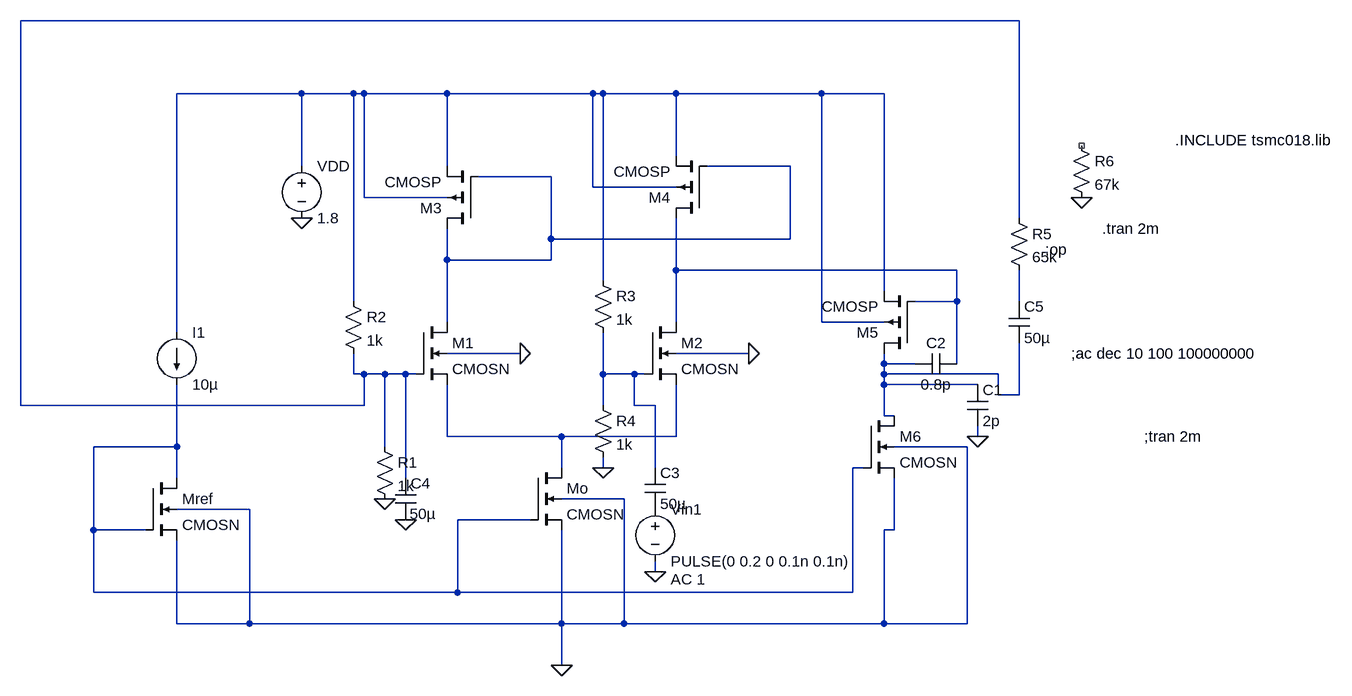
[diagram p0: schematic Schematic.asc]
Schematic.asc, the LTspice schematic file:
Version 4
SHEET 1 1564 724
WIRE 1040 -336 -496 -336
WIRE -64 -224 -256 -224
WIRE 16 -224 -64 -224
WIRE 32 -224 16 -224
WIRE 160 -224 32 -224
WIRE 384 -224 160 -224
WIRE 400 -224 384 -224
WIRE 512 -224 400 -224
WIRE 736 -224 512 -224
WIRE 832 -224 736 -224
WIRE 512 -128 512 -224
WIRE -64 -112 -64 -224
WIRE 160 -112 160 -224
WIRE 688 -112 560 -112
WIRE 320 -96 208 -96
WIRE 384 -80 384 -224
WIRE 512 -80 384 -80
WIRE 32 -64 32 -224
WIRE 160 -64 32 -64
WIRE 1040 -32 1040 -336
WIRE 320 0 320 -96
WIRE 688 0 688 -112
WIRE 688 0 320 0
WIRE 160 32 160 -16
WIRE 320 32 320 0
WIRE 320 32 160 32
WIRE 512 48 512 -32
WIRE 944 48 512 48
WIRE 400 64 400 -224
WIRE 832 80 832 -224
WIRE 16 96 16 -224
WIRE 944 96 944 48
WIRE 944 96 880 96
WIRE 1040 96 1040 48
WIRE 160 128 160 32
WIRE 512 128 512 48
WIRE 736 128 736 -224
WIRE 832 128 736 128
WIRE -256 144 -256 -224
WIRE 272 176 160 176
WIRE 624 176 512 176
WIRE 832 192 832 176
WIRE 880 192 832 192
WIRE 944 192 944 96
WIRE 16 208 16 176
WIRE 32 208 16 208
WIRE 64 208 32 208
WIRE 96 208 64 208
WIRE 112 208 96 208
WIRE 400 208 400 144
WIRE 448 208 400 208
WIRE 464 208 448 208
WIRE 832 208 832 192
WIRE 1008 208 832 208
WIRE 832 224 832 208
WIRE 976 224 832 224
WIRE 1008 240 1008 208
WIRE 1040 240 1040 160
WIRE 1040 240 1008 240
WIRE -496 256 -496 -336
WIRE 32 256 32 208
WIRE 32 256 -496 256
WIRE 400 256 400 208
WIRE 448 256 448 208
WIRE 480 256 448 256
WIRE 832 272 832 224
WIRE 848 272 832 272
WIRE 160 304 160 224
WIRE 336 304 160 304
WIRE 512 304 512 224
WIRE 512 304 336 304
WIRE 976 304 976 288
WIRE -256 320 -256 224
WIRE -256 320 -384 320
WIRE 64 320 64 208
WIRE 960 320 848 320
WIRE 336 352 336 304
WIRE 400 352 400 336
WIRE 480 352 480 256
WIRE 800 352 784 352
WIRE -256 368 -256 320
WIRE 96 368 96 208
WIRE 432 400 336 400
WIRE -144 416 -256 416
WIRE 288 432 176 432
WIRE -384 448 -384 320
WIRE -304 448 -384 448
WIRE 848 448 848 368
WIRE 848 448 832 448
WIRE 480 512 480 496
WIRE -384 544 -384 448
WIRE 176 544 176 432
WIRE 176 544 -384 544
WIRE 784 544 784 352
WIRE 784 544 176 544
WIRE -256 592 -256 464
WIRE -144 592 -144 416
WIRE -144 592 -256 592
WIRE 336 592 336 448
WIRE 336 592 -144 592
WIRE 432 592 432 400
WIRE 432 592 336 592
WIRE 832 592 832 448
WIRE 832 592 432 592
WIRE 960 592 960 320
WIRE 960 592 832 592
WIRE 336 656 336 592
FLAG -64 -32 0
FLAG 336 656 0
FLAG 976 304 0
FLAG 480 512 0
FLAG 64 400 0
FLAG 96 432 0
FLAG 400 352 0
FLAG 624 176 0
FLAG 272 176 0
FLAG 1136 -64 0
SYMBOL cmosn 112 128 R0
SYMATTR InstName M1
SYMATTR Value2 l=900n w=61141.3n
SYMBOL cmosn 464 128 R0
SYMATTR InstName M2
SYMATTR Value2 l=900n w=61141.3n
SYMBOL cmosn 288 352 R0
SYMATTR InstName Mo
SYMATTR Value2 l=900n w=21u
SYMBOL cmosn -304 368 R0
SYMATTR InstName Mref
SYMATTR Value2 l=900n w=2u
SYMBOL cmosp 208 -16 R180
SYMATTR InstName M3
SYMATTR Value2 l=900n w=22500n
SYMBOL cmosp 560 -32 R180
SYMATTR InstName M4
SYMATTR Value2 l=900n w=22500n
SYMBOL voltage -64 -128 R0
SYMATTR InstName VDD
SYMATTR Value 1.8
SYMBOL current -256 144 R0
WINDOW 123 0 0 Left 2
WINDOW 39 0 0 Left 2
SYMATTR InstName I1
SYMATTR Value 10µ
SYMBOL cmosp 880 176 R180
SYMATTR InstName M5
SYMATTR Value2 l=900n w=90000n
SYMBOL cmosn 800 272 R0
SYMATTR InstName M6
SYMATTR Value2 l=900n w=42u
SYMBOL cap 960 224 R0
SYMATTR InstName C1
SYMATTR Value 2p
SYMBOL cap 944 176 R90
WINDOW 0 0 32 VBottom 2
WINDOW 3 32 32 VTop 2
SYMATTR InstName C2
SYMATTR Value 0.8p
SYMBOL cap 464 352 R0
SYMATTR InstName C3
SYMATTR Value 50µ
SYMBOL voltage 480 400 R0
WINDOW 123 24 124 Left 2
WINDOW 39 0 0 Left 2
SYMATTR Value2 AC 1
SYMATTR InstName Vin1
SYMATTR Value PULSE(0 0.2 0 0.1n 0.1n)
SYMBOL cap 80 368 R0
WINDOW 3 22 55 Left 2
SYMATTR Value 50µ
SYMATTR InstName C4
SYMBOL res 48 304 R0
SYMATTR InstName R1
SYMATTR Value 1k
SYMBOL res 0 80 R0
SYMATTR InstName R2
SYMATTR Value 1k
SYMBOL res 384 48 R0
SYMATTR InstName R3
SYMATTR Value 1k
SYMBOL res 384 240 R0
SYMATTR InstName R4
SYMATTR Value 1k
SYMBOL res 1120 -160 R0
SYMATTR InstName R6
SYMATTR Value 67k
SYMBOL cap 1024 96 R0
SYMATTR InstName C5
SYMATTR Value 50µ
SYMBOL res 1024 -48 R0
SYMATTR InstName R5
SYMATTR Value 65k
TEXT 1280 -152 Left 2 !.INCLUDE tsmc018.lib
TEXT 1168 -16 Left 2 !.tran 2m
TEXT 1080 16 Left 2 !;op
TEXT 1232 304 Left 2 !;tran 2m
TEXT 1120 176 Left 2 !;ac dec 10 100 100000000

The netlist it stands for:
* Schematic.asc
M1 N003 N001 N008 0 CMOSN l=900n w=61141.3n
M2 N004 N007 N008 0 CMOSN l=900n w=61141.3n
Mo N008 N009 0 0 CMOSN l=900n w=21u
Mref N009 N009 0 0 CMOSN l=900n w=2u
M3 N003 N003 N002 N002 CMOSP l=900n w=22500n
M4 N004 N003 N002 N002 CMOSP l=900n w=22500n
VDD N002 0 1.8
I1 N002 N009 10µ
M5 N006 N004 N002 N002 CMOSP l=900n w=90000n
M6 N006 N009 0 0 CMOSN l=900n w=42u
C1 N006 0 2p
C2 N004 N006 0.8p
C3 N007 P001 50µ
Vin1 P001 0 PULSE(0 0.2 0 0.1n 0.1n) AC 1
C4 N001 0 50µ
R1 N001 0 1k
R2 N002 N001 1k
R3 N002 N007 1k
R4 N007 0 1k
R6 NC_01 0 67k
C5 N005 N006 50µ
R5 N001 N005 65k
.model NMOS NMOS
.model PMOS PMOS
.lib standard.mos
.INCLUDE tsmc018.lib
.tran 2m
;op
;tran 2m
;ac dec 10 100 100000000
.backanno
.end